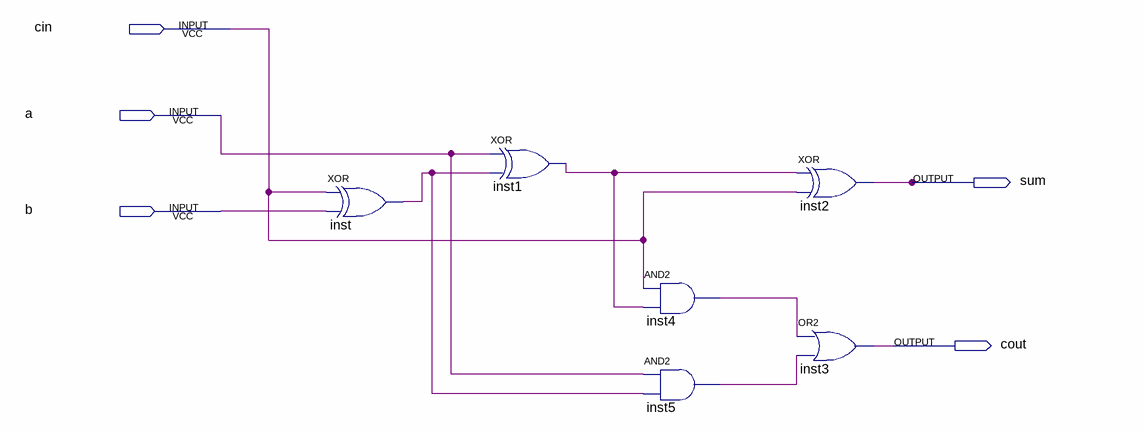
[diagram p0: schematic sheet]
// Quartus schematic one_bit_adder_subtractor.bdf as structural Verilog: 6 symbols, 5 pins
module one_bit_adder_subtractor (
  input  cin,
  input  a,
  input  b,
  output sum,
  output cout
);

  wire inst1_out, inst4_out, inst5_out, inst_out;

  xor inst (inst_out, cin, b);
  xor inst1 (inst1_out, a, inst_out);
  and inst4 (inst4_out, cin, inst1_out);
  and inst5 (inst5_out, a, inst_out);
  xor inst2 (sum, inst1_out, cin);
  or inst3 (cout, inst4_out, inst5_out);
endmodule
